# Altium schematic sheet GeigerChannel.SchDoc
size A3; Author: Ali Zoubir; Organization: ETML-ES; Address1: Avenue Recordon 1; Address2: 1004 Lausanne; Address3: Switzerland; Revision: 1924B; SheetNumber: 2; SheetTotal: 4; SPICEModelCacheGNAZWADN: <root> / <DocumentId>GNAZWADN</DocumentId> / </root>; Version: V0
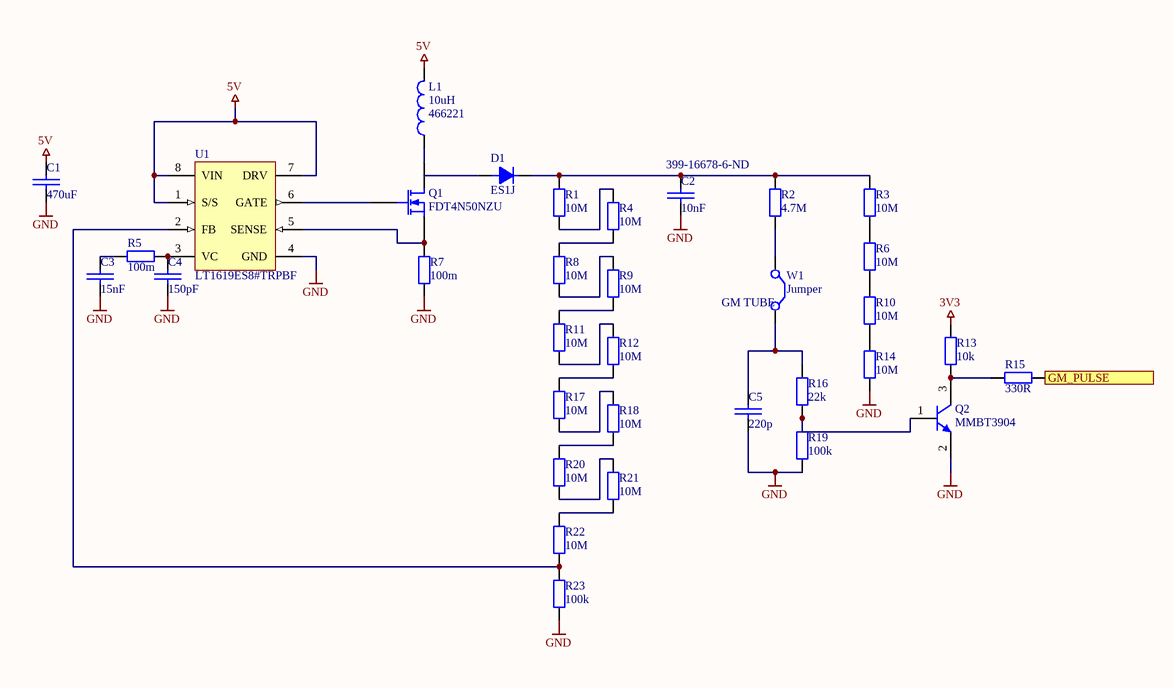
[diagram p0: GeigerChannel.SchDoc]

## Parts
C1  470uF  [Cap_0805]
C2  10nF  Supplier Part Number 1: 399-16678-6-ND  [1206]
C3  15nF  [Cap_0805]
C4  150pF  [Cap_0805]
C5  220p  [1206]
D1  ES1J  [DIOM5227X250N]
L1  10uH  Supplier Part Number 1: 466221  [SRN3015C]
Q1  FDT4N50NZU  [SOT-223]
Q2  MMBT3904  [FAIR-SOT23-3_V]
R1  10M  [RES_0805]
R2  4.7M  [RES_0805]
R3  10M  [RES_0805]
R4  10M  [RES_0805]
R5  100m  [RES_0805]
R6  10M  [RES_0805]
R7  100m  [RES_0805]
R8  10M  [RES_0805]
R9  10M  [RES_0805]
R10  10M  [RES_0805]
R11  10M  [RES_0805]
R12  10M  [RES_0805]
R13  10k  [RES_0805]
R14  10M  [RES_0805]
R15  330R  [RES_0805]
R16  22k  [RES_0805]
R17  10M  [RES_0805]
R18  10M  [RES_0805]
R19  100k  [RES_0805]
R20  10M  [RES_0805]
R21  10M  [RES_0805]
R22  10M  [RES_0805]
R23  100k  [RES_0805]
U1  LT1619ES8#TRPBF  [LT-S8-8_N]
W1  Jumper  [RAD-0.2]

## Ports
GM_PULSE (out)

## Nets
3V3: R13.1
5V: C1.1 L1.2 U1.1(S/S) U1.7(DRV) U1.8(VIN)
GND: C1.2 C2.2 C3.2 C4.2 C5.2 Q2.2(E) R7.2 R14.2 R19.2 R23.2 U1.4(GND)
GM_PULSE: R15.2 ; port GM_PULSE
NetC2_1: C2.1 D1.1(A) R1.1 R2.1 R3.1
NetC3_1: C3.1 R5.1
NetC4_1: C4.1 R5.2 U1.3(VC)
NetC5_1: C5.1 R16.1 W1.2(C2)
NetL1_1: L1.1 Q1.D
NetQ1_G: Q1.G U1.6(GATE)
NetQ1_S: Q1.S R7.1 U1.5(SENSE)
NetQ2_1: Q2.1(B) R16.2 R19.1
NetQ2_3: Q2.3(C) R13.2 R15.1
NetR1_2: R1.2 R4.1
NetR2_2: R2.2 W1.1(C1)
NetR3_2: R3.2 R6.1
NetR4_2: R4.2 R8.1
NetR6_2: R6.2 R10.1
NetR8_2: R8.2 R9.1
NetR9_2: R9.2 R11.1
NetR10_2: R10.2 R14.1
NetR11_2: R11.2 R12.1
NetR12_2: R12.2 R17.1
NetR17_2: R17.2 R18.1
NetR18_2: R18.2 R20.1
NetR20_2: R20.2 R21.1
NetR21_2: R21.2 R22.1
NetR22_2: R22.2 R23.1 U1.2(FB)

Not connected (* = marked no-connect by the designer): D1 2(B)

## Notes on the sheet
- (near W1) GM TUBE
- Fichier :
- a
- Date :
- Heure :
- Version :
- Auteur :
- Modif.
- b
- c
- d
- Projet :
- No :
- Nb feuilles
- Feuille n°
- Chemin :

## Library data of the parts
C1-C5 = C: SDTSourceLibName: C:\WINDOWS\TEMP\DA.LIB; PCB Footprint: RC0805
  C2 C5: Supplier 1: DigiKey
D1 = ES1J: Ð”Ð¸Ð¾Ð´, ÑÐ²ÐµÑ€Ñ…Ð±Ñ‹ÑÑ‚Ñ€Ñ‹Ð¹, SMA, 600 Ð’, 1 Ð, 35 Ð½Ñ, 150 Â°C; MF: Diotec Semiconductor; SnapEDA_Link: https://www.snapeda.com/parts/ES1J/Diotec/view-part/?ref=snap; Package: DO-214AC Diotec; Value: *; MP: ES1J; Check_prices: https://www.snapeda.com/parts/ES1J/Diotec/view-part/?ref=eda
L1 = Inductor: Code_IEC: 1005; Published: 8-Jun-2000; LatestRevisionDate: 29-May-2009; LatestRevisionNote: IPC-7351 Footprint Added.; PackageReference: 0402-A; Publisher: Altium Limited; PackageDescription: Chip Inductor; Code_JEITA: 0402; Value: 10uH; Supplier 1: RS
Q2 = CMP-1670-00008-1: NPN General Purpose Amplifier, 40 V, 0.2 A, -55 to 150 degC, 3-Pin SOT23, RoHS, Tape and Reel; Tolerance: 30ppm; Capacitance: 1.8E-11 f; Frequency: 12.288 MHz; ESR: 40 Ohm; Load Capacitance: 18 pF; REACH SVHC: No SVHC; Pins: 4; ComponentLink3URL: http://www.fairchildsemi.com/dwg/MA/MA03D.pdf; PackageDescription: 3-Pin Small Outline Transistor, Body 2.92 x 1.325 mm, Pitch 0.95 mm; ComponentLink1URL: https://www.fairchildsemi.com/; Max Operating Temperature: 70degC; PackageReference: SOT23-3; ComponentLink1Description: Manufacturer URL; Width: 0.126 inch; Min Operating Temperature: -20degC; DatasheetVersion: Rev. 1.1.0, 10/2014; Mount: Surface Mount; Height: 0.041 inch; Package Quantity: 1000; Frequency Tolerance: 30ppm; Packaging: Tape and Reel; ComponentLink2URL: https://www.fairchildsemi.com/datasheets/MM/MMBT3904.pdf; RoHSCompliant: True; ComponentLink3Description: Package Specification; ComponentLink2Description: Datasheet; Length: 0.197 inch
R1-R23 = CMP-2001-00528-1: Res 0805; Part Number: ERJ6ENF2703V; Manufacturer: Panasonic
U1 = CMP-0491-01756-1: Low Voltage Current Mode PWM Controller, 8-pin SOIC (S8-8), -40 to 85 degC, Pb-Free, Tape and Reel; Manufacturer: Linear Technology; Number of Outputs: 1; ComponentLink1Description: Manufacturer URL; Packing: Tape and Reel; ComponentLink2Description: Datasheet; ComponentLink2URL: http://cds.linear.com/docs/en/datasheet/1619fa.pdf; ComponentLink1URL: http://www.linear.com/; Mounting Technology: Surface Mount; RoHS: TRUE; ComponentLink3URL: http://cds.linear.com/docs/en/packaging/05081610_G_SO8.pdf; PackageReference: S8-8; PackageVersion: Rev. G, 03/2012; DatasheetVersion: Rev. A; ComponentLink3Description: Package Specification; PartNumber: LT1619ES8#TRPBF; PackageDescription: 8-Pin Plastic Small Outline (Narrow .150 Inch), Body 4.9 x 3.9 mm, Pitch 1.27 mm
W1 = Jumper: Jumper Wire; Published: 24-Mar-1999; LatestRevisionDate: 17-Jul-2002; LatestRevisionNote: Re-released for DXP Platform.; PackageReference: RAD-0.2; Publisher: Altium Limited; PackageDescription: Radial Cap, Thru-Hole; 2 Leads; 0.2 in Pin Spacing